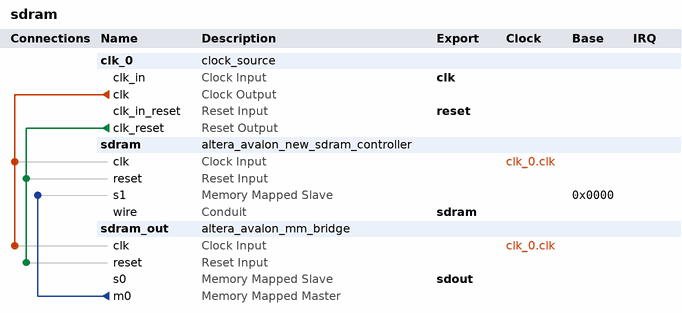
[diagram p0: system contents]
# Platform Designer (Qsys) system sdram, Cyclone IV E EP4CE22F17C6
# Parameters at their usual value, and those the tool derives, are not listed.
package require -exact qsys 17.1
create_system sdram
set_project_property DEVICE_FAMILY {Cyclone IV E}
set_project_property DEVICE EP4CE22F17C6

add_instance clk_0 clock_source 17.1
set_instance_parameter_value clk_0 clockFrequency 50000000

add_instance sdram altera_avalon_new_sdram_controller 17.1
set_instance_parameter_value sdram TAC 5.5
set_instance_parameter_value sdram TRCD 20.0
set_instance_parameter_value sdram TRP 20.0
set_instance_parameter_value sdram casLatency 3
set_instance_parameter_value sdram columnWidth 9
set_instance_parameter_value sdram dataWidth 16
set_instance_parameter_value sdram generateSimulationModel false
set_instance_parameter_value sdram model single_Micron_MT48LC4M32B2_7_chip
set_instance_parameter_value sdram numberOfBanks 4
set_instance_parameter_value sdram numberOfChipSelects 1
set_instance_parameter_value sdram powerUpDelay 100.0
set_instance_parameter_value sdram refreshPeriod 15.625
set_instance_parameter_value sdram rowWidth 13

add_instance sdram_out altera_avalon_mm_bridge 17.1
set_instance_parameter_value sdram_out ADDRESS_UNITS SYMBOLS
set_instance_parameter_value sdram_out ADDRESS_WIDTH 26
set_instance_parameter_value sdram_out DATA_WIDTH 32
set_instance_parameter_value sdram_out MAX_PENDING_RESPONSES 4
set_instance_parameter_value sdram_out USE_AUTO_ADDRESS_WIDTH 0

# connections
add_connection clk_0.clk sdram.clk clock
add_connection clk_0.clk sdram_out.clk clock
add_connection clk_0.clk_reset sdram.reset reset
add_connection clk_0.clk_reset sdram_out.reset reset
add_connection sdram_out.m0 sdram.s1 avalon
set_connection_parameter_value sdram_out.m0/sdram.s1 baseAddress 0x0000

# exported interfaces
add_interface clk clock sink
set_interface_property clk EXPORT_OF clk_0.clk_in
add_interface reset reset sink
set_interface_property reset EXPORT_OF clk_0.clk_in_reset
add_interface sdout avalon slave
set_interface_property sdout EXPORT_OF sdram_out.s0
add_interface sdram conduit end
set_interface_property sdram EXPORT_OF sdram.wire

set_interconnect_requirement {$system} qsys_mm.clockCrossingAdapter HANDSHAKE
set_interconnect_requirement {$system} qsys_mm.enableEccProtection FALSE
set_interconnect_requirement {$system} qsys_mm.insertDefaultSlave FALSE
set_interconnect_requirement {$system} qsys_mm.maxAdditionalLatency 1

save_system sdram.qsys
